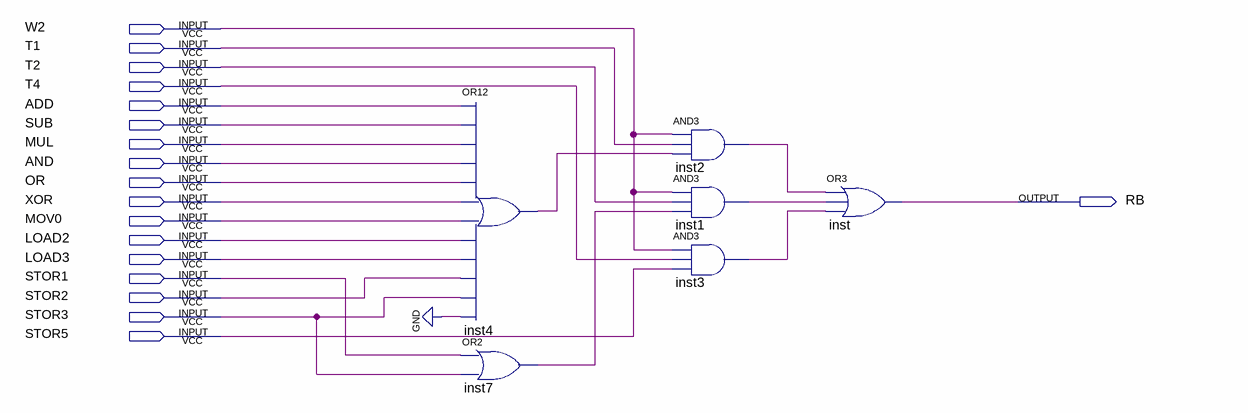
[diagram p0: schematic sheet]
// Quartus schematic RB.bdf as structural Verilog: 6 symbols, 18 pins
module RB (
  input  W2,
  input  T1,
  input  T2,
  input  T4,
  input  ADD,
  input  SUB,
  input  MUL,
  input  AND,
  input  OR,
  input  XOR,
  input  MOV0,
  input  LOAD2,
  input  LOAD3,
  input  STOR1,
  input  STOR2,
  input  STOR3,
  input  STOR5,
  output RB
);

  wire inst1_out, inst2_out, inst3_out, inst4_out, inst7_out;

  or inst4 (inst4_out, ADD, SUB, MUL, AND, OR, XOR, MOV0, LOAD2, LOAD3, STOR2, STOR3, 1'b0);
  or inst7 (inst7_out, STOR1, STOR3);
  and inst2 (inst2_out, W2, T1, inst4_out);
  and inst1 (inst1_out, W2, T2, inst7_out);
  and inst3 (inst3_out, W2, T4, STOR5);
  or inst (RB, inst2_out, inst1_out, inst3_out);
endmodule
